# EAGLE schematic vending-machine-v2-optosensor-r1-panelized (EAGLE 5.11)
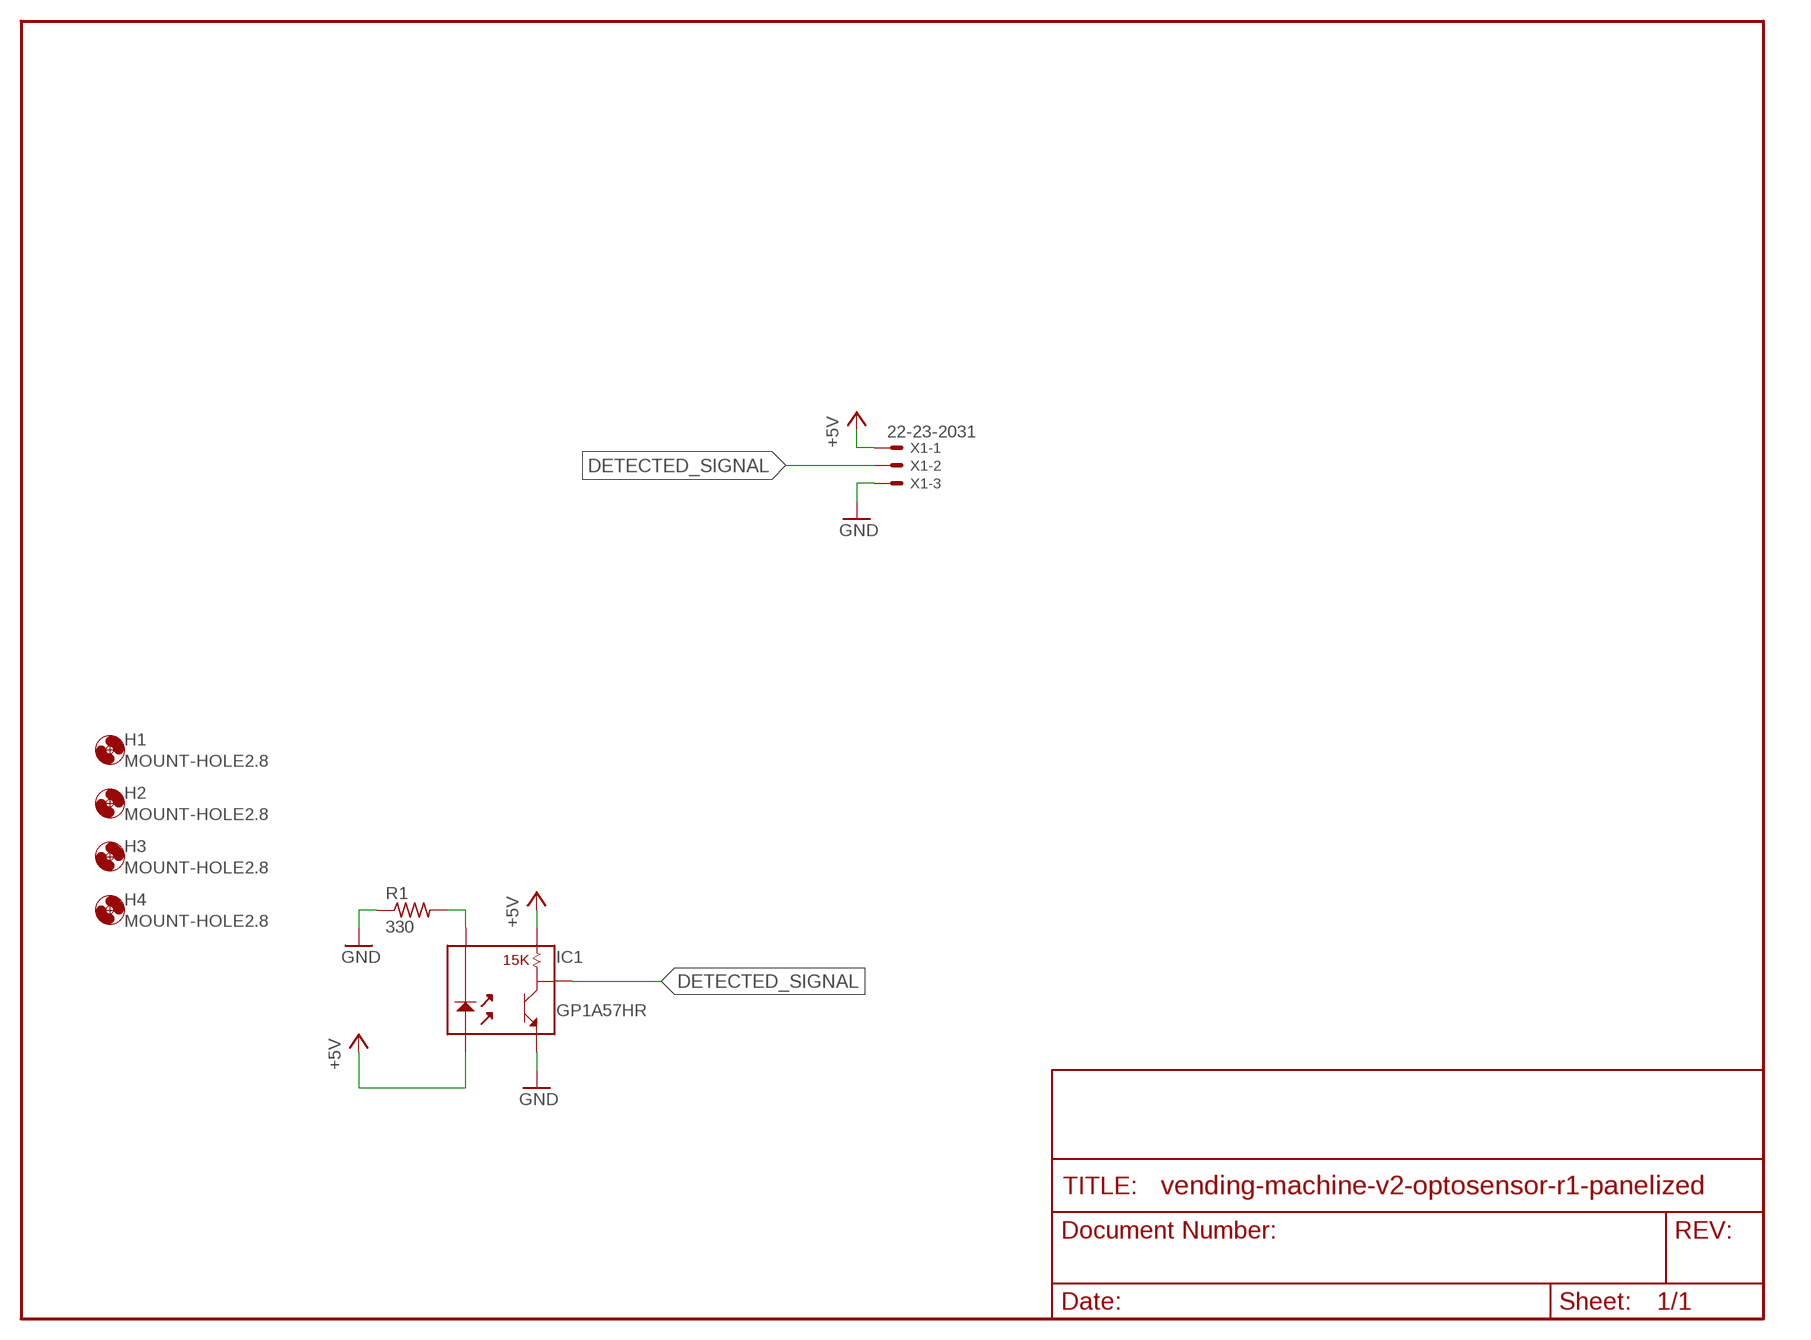
[diagram p0: schematic, sheet 1]

## Parts
H1  MOUNT-HOLE2.8  [2,8]
H2  MOUNT-HOLE2.8  [2,8]
H3  MOUNT-HOLE2.8  [2,8]
H4  MOUNT-HOLE2.8  [2,8]
IC1  GP1A57HR  [GP1A57HR]
R1  330  R-US_0204/5  [0204/5]
X1  22-23-2031  [22-23-2031]

## Nets
+5V: IC1.1 IC1.3 X1.1
DETECTED_SIGNAL: IC1.4 X1.2
GND: IC1.5 R1.1 X1.3
N$8: IC1.2 R1.2

## Library data of the parts
H1-H4 = holes:MOUNT-HOLE: MOUNTING HOLE with drill center marker
IC1 = SparkFun:GP1A57HR
R1 = rcl:R-US_: RESISTOR, American symbol
X1 = con-molex:22-23-2031: .100" (2.54mm) Center Header - 3 Pin; MF: MOLEX; MPN: 22-23-2031; OC_FARNELL: 1462950; OC_NEWARK: 30C0862